# EAGLE schematic BTP_gateway_board (EAGLE 9.2.2)
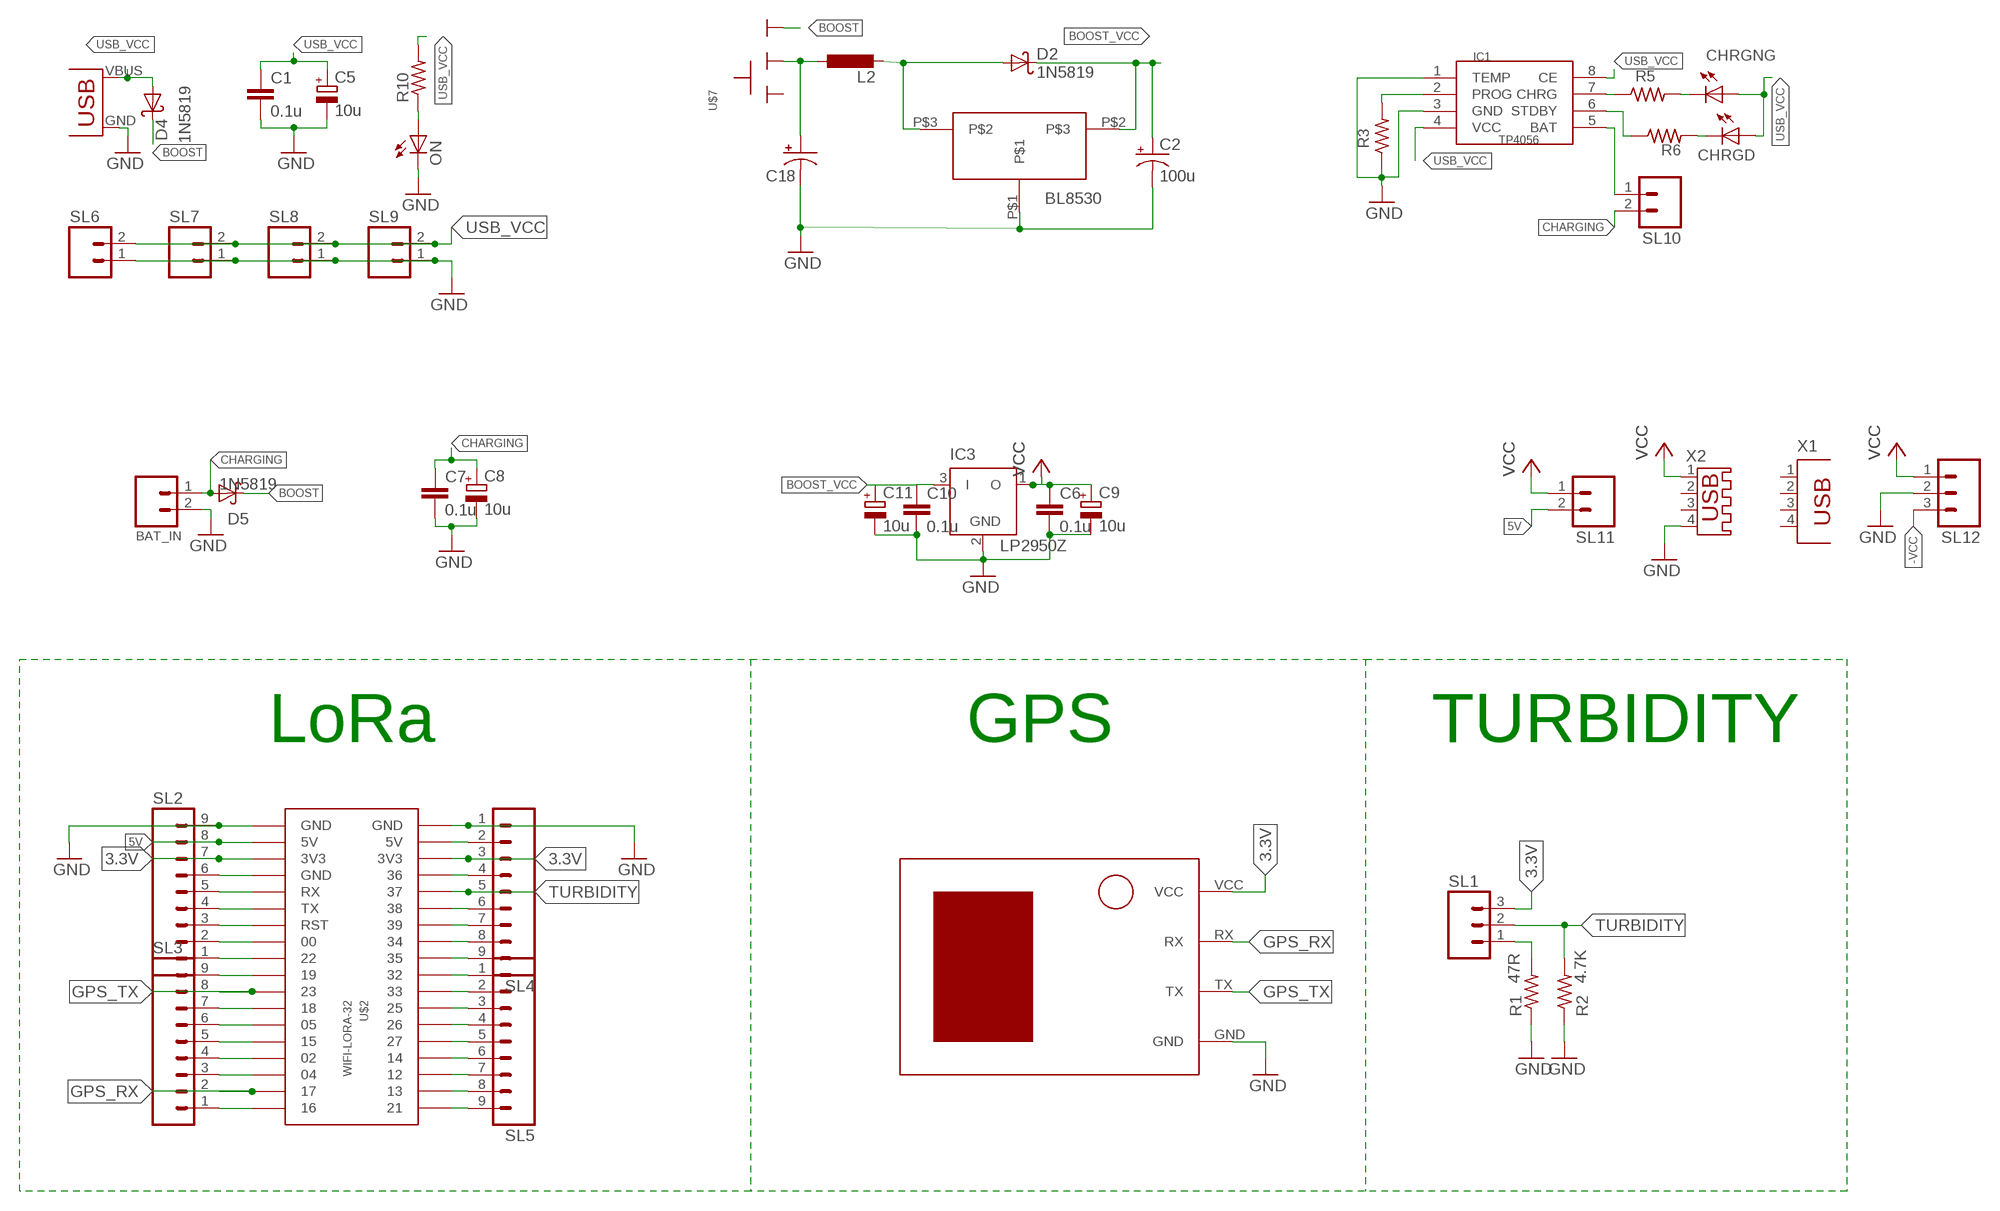
[diagram p0: schematic, sheet 1]

## Parts
BAT_IN  M02  [02P]
BL1  BL8530_5V  [BL8530_5V]
C1  0.1u  C-EU025-024X044  [C025-024X044]
C2  100u  CAP_POL_10V  [C/6032-28R]
C5  10u  CPOL-EUE2.5-5  [E2,5-5]
C6  0.1u  C-EU025-024X044  [C025-024X044]
C7  0.1u  C-EU025-024X044  [C025-024X044]
C8  10u  CPOL-EUE2.5-5  [E2,5-5]
C9  10u  CPOL-EUE2.5-5  [E2,5-5]
C10  0.1u  C-EU025-024X044  [C025-024X044]
C11  10u  CPOL-EUE2.5-5  [E2,5-5]
C18  10u  CAP_POL_10V  [C/6032-28R]
CHRGD  LED3MM  [LED3MM]
CHRGNG  LED3MM  [LED3MM]
D2  1N5819  [DO41-10]
D4  1N5819  [DO41-10]
D5  1N5819  [DO41-10]
IC1  TP4056  [SOP-8]
IC3  LP2950Z  [TO92]
L2  47uH  L-EUL4532P  [L4532P]
ON  LED3MM  [LED3MM]
R1  47R  RESISTOR0207/7  [0207/7]
R2  4.7K  RESISTOR0207/7  [0207/7]
R3  10K  RESISTOR0805  [R0805]
R5  470  RESISTOR0805  [R0805]
R6  470  RESISTOR0805  [R0805]
R10  RESISTOR0805  [R0805]
SL1  M03  [03P]
SL2  M09  [09P]
SL3  M09  [09P]
SL4  M09  [09P]
SL5  M09  [09P]
SL6  M02  [02P]
SL7  M02  [02P]
SL8  M02  [02P]
SL9  M02  [02P]
SL10  M02  [02P]
SL11  M02  [02P]
SL12  M03  [03P]
U$1  U-BLOX-NEO6V2  [U-BLOX-NEO6V2]
U$2  WIFI-LORA-32  [2.54MM_2X18]
U$3  USB(POWER)  [USB(POWER)]
U$7  SLIDESWITCH-SMALL  [SMALLSWITCH]
X1  PN87520  [PN87520]
X2  USB-A003  [USB-A003]

## Nets
3.3V: SL1.3 SL2.7 SL4.3 U$1.VCC U$2.P$3(3V3) U$2.P$34(3V3)
5V: SL2.8 SL11.2 U$2.P$2(5V)
5V@2: SL4.2 U$2.P$35(5V)
-VCC: SL12.3
BOOST: D4.C D5.C U$7.3
BOOST1: C18.+ L2.1 U$7.2
BOOST_VCC: BL1.P$2 C2.+ C10.1 C11.+ D2.C IC3.3(I)
CHARGING: BAT_IN.1 C7.1 C8.+ D5.A SL10.2
GND: BAT_IN.2 BL1.P$1 C1.2 C2.- C5.- C6.2 C7.2 C8.- C9.- C10.2 C11.- C18.- IC1.1(TEMP) IC1.3(GND) IC3.2(GND) ON.K(C) R1.1 R2.1 R3.1 SL2.9 SL4.1 SL6.1 SL7.1 SL8.1 SL9.1 SL12.2 U$1.GND U$2.P$1(GND) U$2.P$36(GND) U$3.GND X2.4
GPS_RX: SL3.2 U$1.RX U$2.P$17
GPS_TX: SL3.8 U$1.TX U$2.P$11
N$2: R1.2 SL1.1
N$3: BL1.P$3 D2.A L2.2
N$4: SL5.1 U$2.P$27
N$5: SL5.2 U$2.P$26
N$6: SL5.3 U$2.P$25
N$7: SL5.4 U$2.P$24
N$8: SL5.5 U$2.P$23
N$9: IC1.2(PROG) R3.2
N$10: SL5.6 U$2.P$22
N$11: CHRGNG.K(C) R5.2
N$12: CHRGD.K(C) R6.2
N$13: ON.A R10.1
N$14: IC1.7(CHRG) R5.1
N$15: IC1.6(STDBY) R6.1
N$16: SL5.7 U$2.P$21
N$17: SL5.8 U$2.P$20
N$18: SL5.9 U$2.P$19
N$19: SL4.4 U$2.P$33
N$20: SL4.6 U$2.P$31
N$21: SL4.7 U$2.P$30
N$22: SL4.8 U$2.P$29
N$23: SL4.9 U$2.P$28
N$24: SL3.1 U$2.P$18
N$25: SL3.4 U$2.P$15
N$26: SL3.5 U$2.P$14
N$27: SL3.6 U$2.P$13
N$28: SL3.7 U$2.P$12
N$29: SL3.9 U$2.P$10
N$30: SL3.3 U$2.P$16
N$31: SL2.1 U$2.P$9
N$32: SL2.2 U$2.P$8
N$33: SL2.3 U$2.P$7(RST)
N$34: SL2.4 U$2.P$6(TX)
N$35: SL2.5 U$2.P$5(RX)
N$36: SL2.6 U$2.P$4(GND)
N$37: IC1.5(BAT) SL10.1
TURBIDITY: R2.2 SL1.2 SL4.5 U$2.P$32
USB_VCC: C1.1 C5.+ CHRGD.A CHRGNG.A D4.A IC1.4(VCC) IC1.8(CE) R10.2 SL6.2 SL7.2 SL8.2 SL9.2 U$3.VBUS(VCC)
VCC: C6.1 C9.+ IC3.1(O) SL11.1 SL12.1 X2.1
Unconnected: U$7.1 X1.1 X1.2 X1.3 X1.4 X2.2 X2.3

## Notes on the sheet
- BL8530
- LoRa | GPS | TURBIDITY

## Library data of the parts
BAT_IN = CEDT:M02: AMP QUICK CONNECTOR; MF: NEXPERIA; MPN: 2N7002PW,115; OC_FARNELL: 1829184
BL1 = PSU_TT_SMD:BL8530_5V; OC_FARNELL: unknown
C1 C6 C7 C10 = rcl:C-EU: CAPACITOR, European symbol; SPICEPREFIX: C
C2 = CEDT_JANUARY_2015_v7:CAP_POL; OC_FARNELL: unknown
C5 C8 C9 C11 = rcl:CPOL-EU: POLARIZED CAPACITOR, European symbol; SPICEPREFIX: C
C18 = CEDT_JANUARY_2015_v5:CAP_POL; OC_FARNELL: unknown
CHRGD CHRGNG = Arduino_Hackathon_v5:LED; OC_FARNELL: unknown
D2 D4 D5 = CEDT_JANUARY_2015_v5:1N5819: DIODE general purpose rectifier, 1 A; OC_FARNELL: unknown
IC1 = tp4056:TP4056; OC_FARNELL: unknown
IC3 = linear:LP2950: 100 mA, Low Power Low Dropout Voltage Regulator Source: http://www.onsemi.com/pub/Collateral/LP2950-D.PDF
L2 = rcl:L-EU: INDUCTOR, European symbol; OC_FARNELL: unknown; SPICEPREFIX: L
ON = CEDT:LED; OC_FARNELL: unknown
R1 R2 = CEDT_JANUARY_2015_v7:RESISTOR
R3 R5 R6 = CEDT_JANUARY_2015_v5:RESISTOR; OC_FARNELL: unknown
R10 = CEDT:RESISTOR; OC_FARNELL: unknown
SL1 SL12 = con-amp-quick:M03: AMP QUICK CONNECTOR; OC_FARNELL: unknown; OC_NEWARK: unknown
SL2-SL5 = con-amp-quick:M09: AMP QUICK CONNECTOR; OC_FARNELL: unknown; OC_NEWARK: unknown
SL6-SL11 = CEDT_JANUARY_2015_v7:M02: AMP QUICK CONNECTOR
U$1 = u-blox neo-6m v2:U-BLOX-NEO6V2
U$2 = ESP32_modules:WIFI-LORA-32
U$3 = CEDT_JANUARY_2015_v5:USB(POWER)
U$7 = CEDT_JANUARY_2015_v5:SLIDESWITCH
X1 = con-berg:PN87520: BERG USB connector; OC_FARNELL: unknown; OC_NEWARK: unknown
X2 = con-yamaichi:USB-A003: USB connector; OC_FARNELL: unknown; OC_NEWARK: unknown

## Net classes
0 default: width 0.406 mm